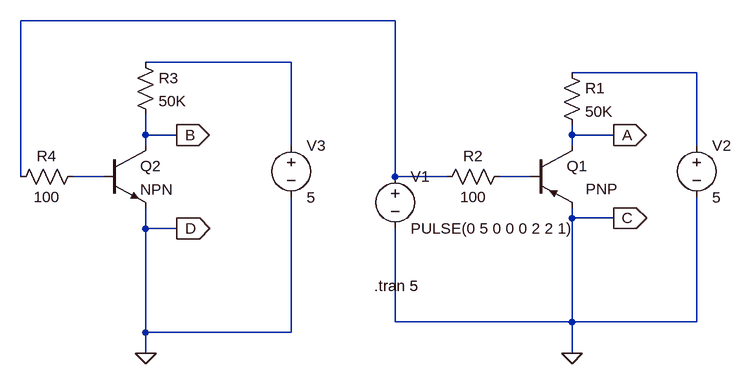
[diagram p0: schematic Working_npn&pnp.asc]
Working_npn&pnp.asc, the LTspice schematic file:
Version 4
SHEET 1 880 680
WIRE -48 -48 -624 -48
WIRE -208 16 -432 16
WIRE 416 32 224 32
WIRE -432 128 -432 96
WIRE -384 128 -432 128
WIRE 224 128 224 112
WIRE 288 128 224 128
WIRE -432 144 -432 128
WIRE -208 144 -208 16
WIRE 224 144 224 128
WIRE 416 144 416 32
WIRE -624 192 -624 -48
WIRE -496 192 -544 192
WIRE -48 192 -48 -48
WIRE 32 192 -48 192
WIRE 160 192 112 192
WIRE 224 256 224 240
WIRE 288 256 224 256
WIRE -432 272 -432 240
WIRE -384 272 -432 272
WIRE -48 416 -48 272
WIRE 224 416 224 256
WIRE 224 416 -48 416
WIRE 416 416 416 224
WIRE 416 416 224 416
WIRE -432 432 -432 272
WIRE -208 432 -208 224
WIRE -208 432 -432 432
WIRE -432 464 -432 432
WIRE 224 464 224 416
FLAG 288 128 A
IOPIN 288 128 Out
FLAG -384 128 B
IOPIN -384 128 Out
FLAG 288 256 C
IOPIN 288 256 Out
FLAG -384 272 D
IOPIN -384 272 Out
FLAG 224 464 0
FLAG -432 464 0
SYMBOL pnp 160 144 R0
WINDOW 3 85 67 Left 2
SYMATTR InstName Q1
SYMBOL res 208 16 R0
SYMATTR InstName R1
SYMATTR Value 50K
SYMBOL res 128 176 R90
WINDOW 0 0 56 VBottom 2
WINDOW 3 32 56 VTop 2
SYMATTR InstName R2
SYMATTR Value 100
SYMBOL voltage -48 176 R0
WINDOW 123 0 0 Left 0
WINDOW 39 0 0 Left 0
SYMATTR InstName V1
SYMATTR Value PULSE(0 5 0 0 0 2 2 1)
SYMBOL voltage 416 128 R0
WINDOW 123 0 0 Left 0
WINDOW 39 0 0 Left 0
SYMATTR InstName V2
SYMATTR Value 5
SYMBOL npn -496 144 R0
SYMATTR InstName Q2
SYMBOL res -448 0 R0
SYMATTR InstName R3
SYMATTR Value 50K
SYMBOL res -528 176 R90
WINDOW 0 0 56 VBottom 2
WINDOW 3 32 56 VTop 2
SYMATTR InstName R4
SYMATTR Value 100
SYMBOL voltage -208 128 R0
SYMATTR InstName V3
SYMATTR Value 5
TEXT -80 360 Left 2 !.tran 5

The netlist it stands for:
* Working_npn&pnp.asc
Q1 A N005 0 0 PNP
R1 N003 A 50K
R2 N005 N001 100
V1 N001 0 PULSE(0 5 0 0 0 2 2 1)
V2 N003 0 5
Q2 B N004 0 0 NPN
R3 N002 B 50K
R4 N004 N001 100
V3 N002 0 5
.model NPN NPN
.model PNP PNP
.lib standard.bjt
.tran 5
.backanno
.end